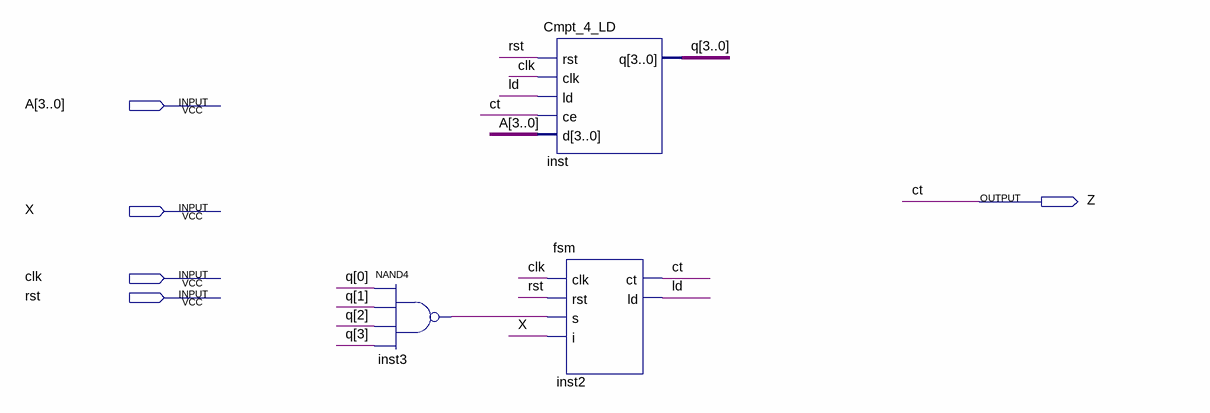
[diagram p0: schematic sheet]
// Quartus schematic 2021P.bdf as structural Verilog: 3 symbols, 5 pins
module \2021P  (
  input  [3:0] A,
  input  X,
  input  clk,
  input  rst,
  output Z
);

  wire inst3_out, ld;
  wire [3:0] q;

  nand inst3 (inst3_out, q[0], q[1], q[2], q[3]);
  Cmpt_4_LD inst (.rst(rst), .clk(clk), .ld(ld), .ce(Z), .d(A), .q(q));
  fsm inst2 (.clk(clk), .rst(rst), .s(inst3_out), .i(X), .ct(Z), .ld(ld));

  // Other names for the same wires on the sheet: ct = Z
endmodule
